# Altium schematic sheet solar_power.SchDoc
size B
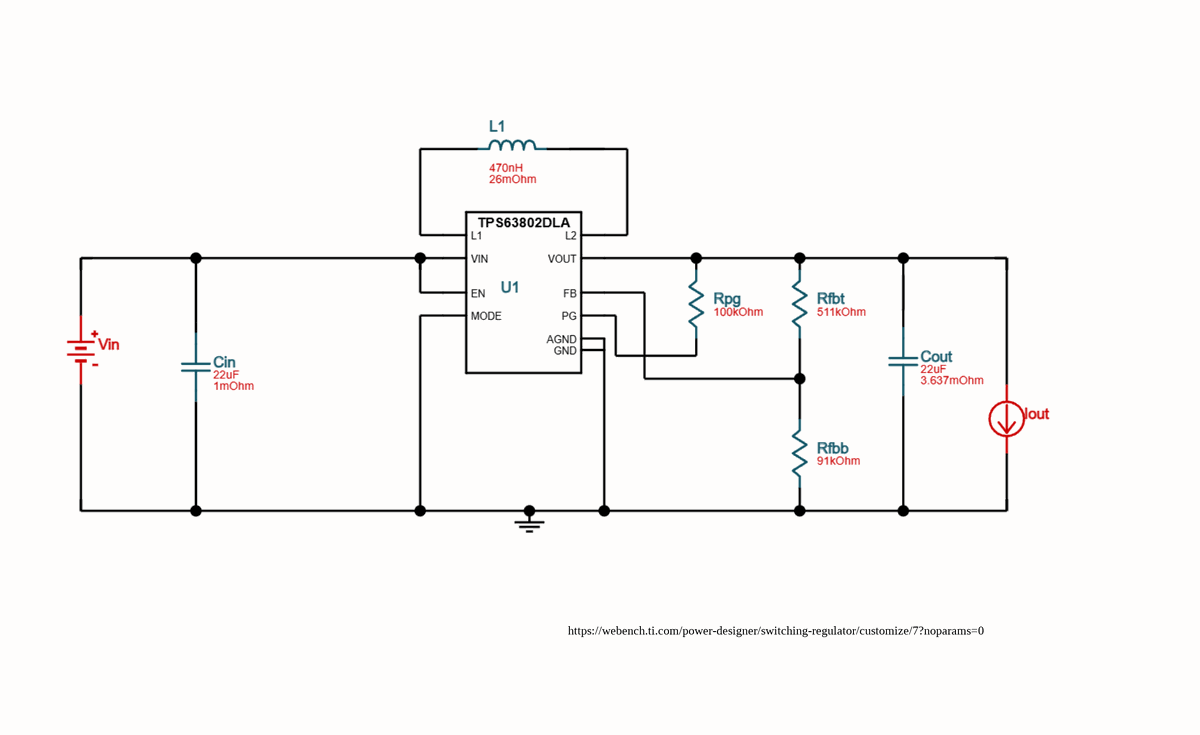
[diagram p0: solar_power.SchDoc, left]
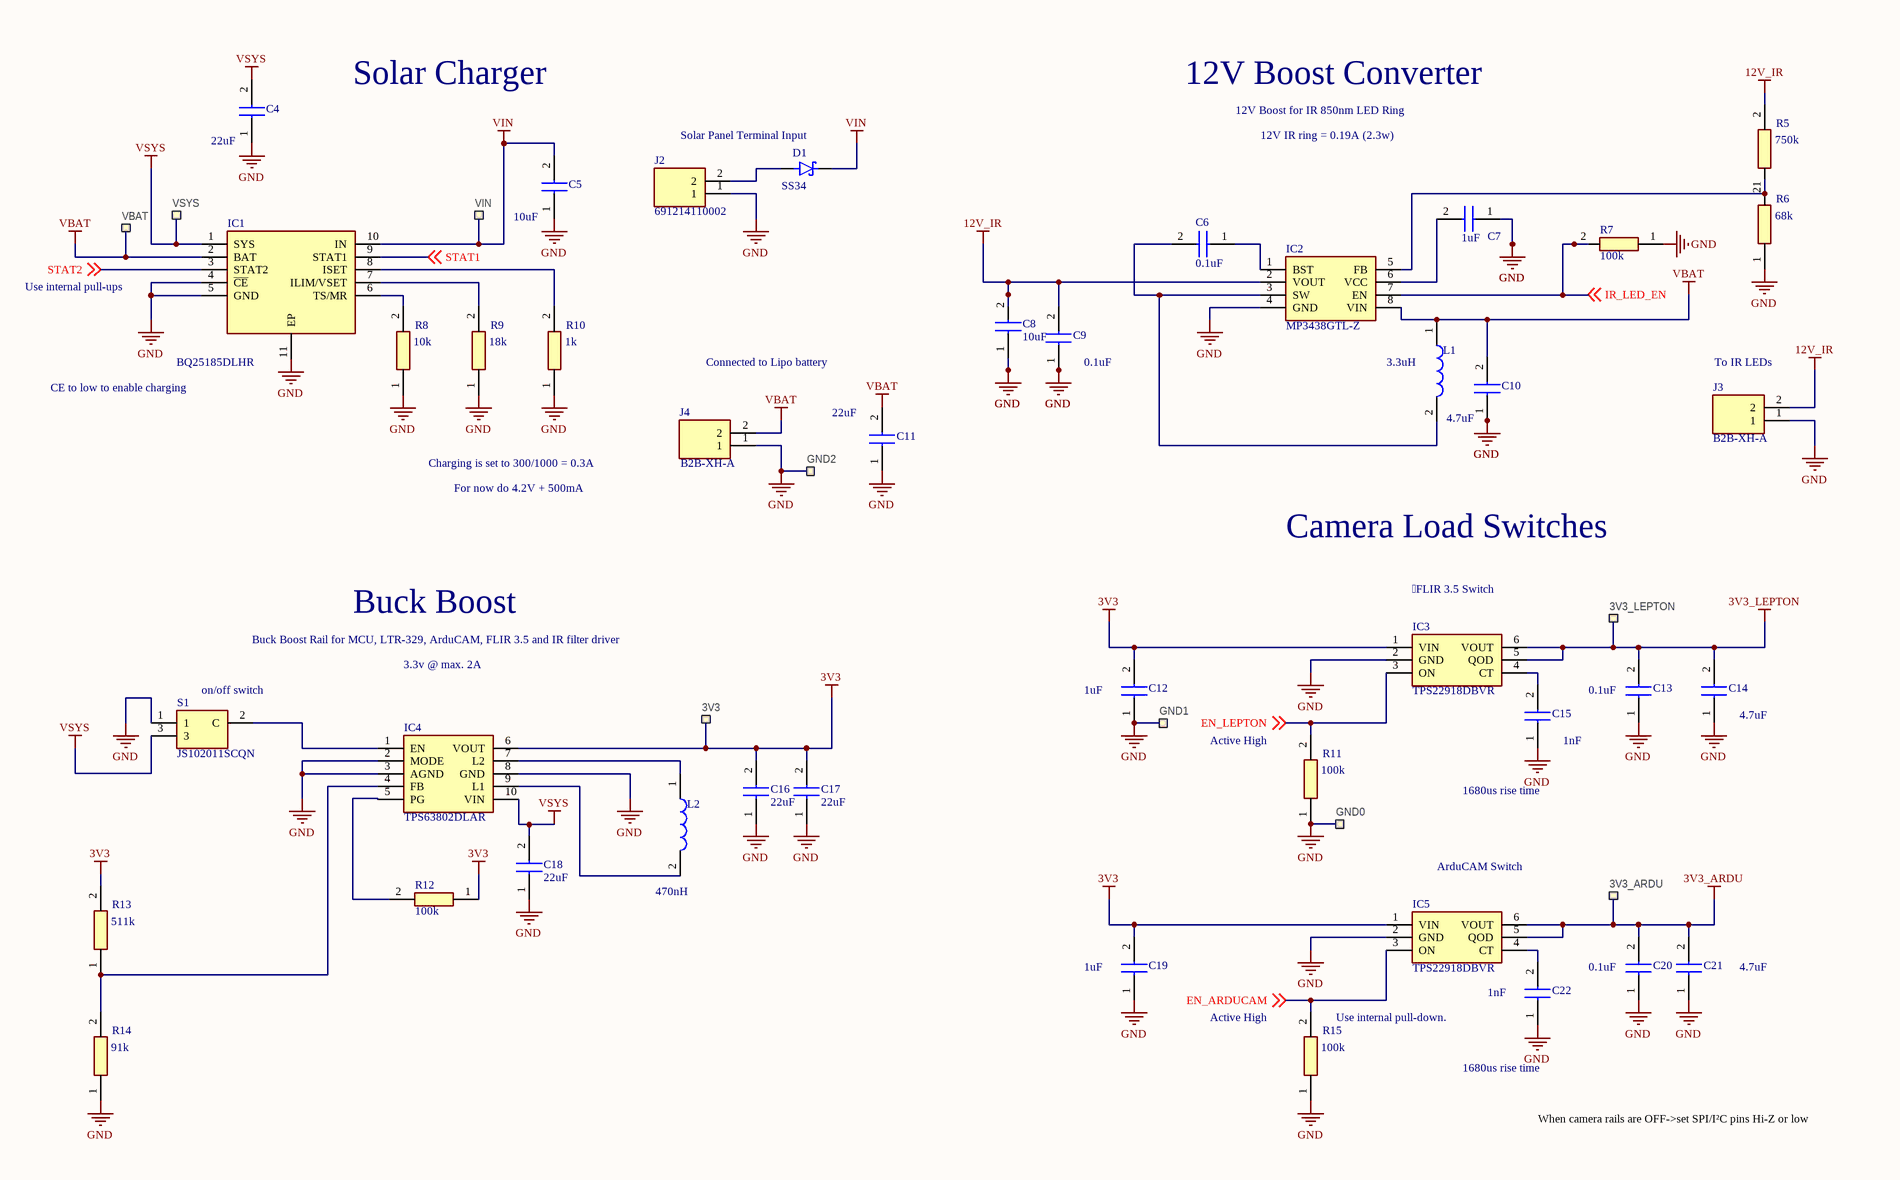
[diagram p1: solar_power.SchDoc, right]

## Parts
3V3  Ø1.0mm,SMD  [TP_SMD_D1.0mm]  (value not drawn)  (no BOM)
3V3_ARDU  Ø1.0mm,SMD  [TP_SMD_D1.0mm]  (value not drawn)  (no BOM)
3V3_LEPTON  Ø1.0mm,SMD  [TP_SMD_D1.0mm]  (value not drawn)  (no BOM)
C4  22uF  [CAPC2114X95N]
C5  10uF  [CAPC2114X95N]
C6  0.1uF  [CAPC1608X90N]
C7  1uF  [CAPC1608X90N]
C8  10uF  [CAPC2114X95N]
C9  0.1uF  [CAPC1608X90N]
C10  4.7uF  [CAPC2114X95N]
C11  22uF  [CAPC2114X95N]
C12  1uF  [CAPC1608X90N]
C13  0.1uF  [CAPC1608X90N]
C14  4.7uF  [CAPC1608X90N]
C15  1nF  [CAPC1608X90N]
C16  22uF  [CAPC2114X95N]
C17  22uF  [CAPC2114X95N]
C18  22uF  [CAPC2114X95N]
C19  1uF  [CAPC1608X90N]
C20  0.1uF  [CAPC1608X90N]
C21  4.7uF  [CAPC1608X90N]
C22  1nF  [CAPC1608X90N]
D1  SS34  [DIOM7959X265N]
GND0  Ø1.0mm,SMD  [TP_SMD_D1.0mm]  (value not drawn)  (no BOM)
GND1  Ø1.0mm,SMD  [TP_SMD_D1.0mm]  (value not drawn)  (no BOM)
GND2  Ø1.0mm,SMD  [TP_SMD_D1.0mm]  (value not drawn)  (no BOM)
IC1  BQ25185DLHR  [SON40P220X200X80-11N]
IC2  MP3438GTL-Z  [SOTFL50P160X60-8N]
IC3  TPS22918DBVR  [SOT95P280X145-6N]
IC4  TPS63802DLAR  [TPS63802DLAR]
IC5  TPS22918DBVR  [SOT95P280X145-6N]
J2  691214110002  [691214110002]
J3  B2B-XH-A  [SHDR2W64P0X250_1X2_740X575X700P]
J4  B2B-XH-A  [SHDR2W64P0X250_1X2_740X575X700P]
L1  3.3uH  [MPLAL40203R3]
L2  470nH  [1285ASH1R0MP2]
R5  750k  [RESC1608X55N]
R6  68k  [RESC1608X55N]
R7  100k  [RESC1608X55N]
R8  10k  [RESC1608X55N]
R9  18k  [RESC1608X55N]
R10  1k  [RESC1608X55N]
R11  100k  [RESC1608X55N]
R12  100k  [RESC1608X55N]
R13  511k  [RESC1608X55N]
R14  91k  [RESC1608X55N]
R15  100k  [RESC1608X55N]
S1  JS102011SCQN  [JS102011SCQN]
VBAT  Ø1.0mm,SMD  [TP_SMD_D1.0mm]  (value not drawn)  (no BOM)
VIN  Ø1.0mm,SMD  [TP_SMD_D1.0mm]  (value not drawn)  (no BOM)
VSYS  Ø1.0mm,SMD  [TP_SMD_D1.0mm]  (value not drawn)  (no BOM)

## Nets
3V3: 3V3.1 C12.2 C16.2 C17.2 C19.2 IC3.1(VIN) IC4.6(VOUT) IC5.1(VIN) R12.1 R13.2
3V3_ARDU: 3V3_ARDU.1 C20.2 C21.2 IC5.5(QOD) IC5.6(VOUT)
3V3_LEPTON: 3V3_LEPTON.1 C13.2 C14.2 IC3.5(QOD) IC3.6(VOUT)
12V_IR: C8.2 C9.2 IC2.2(VOUT) J3.2 R5.2
GND: C4.1 C5.1 C7.1 C8.1 C9.1 C10.1 C11.1 C12.1 C13.1 C14.1 C15.1 C16.1 C17.1 C18.1 C19.1 C20.1 C21.1 C22.1 GND0.1 GND1.1 GND2.1 IC1.4(~{CE}) IC1.5(GND) IC1.11(EP) IC2.4(GND) IC3.2(GND) IC4.2(MODE) IC4.3(AGND) IC4.8(GND) IC5.2(GND) J2.1 J3.1 J4.1 R6.1 R7.1 R8.1 R9.1 R10.1 R11.1 R14.1 R15.1 S1.1
VBAT: C10.2 C11.2 IC1.2(BAT) IC2.8(VIN) J4.2 L1.1 VBAT.1
VIN: C5.2 D1.C(K) IC1.10(IN) VIN.1
VSYS: C4.2 C18.2 IC1.1(SYS) IC4.10(VIN) S1.3 VSYS.1
EN_ARDUCAM: IC5.3(ON) R15.2 ; off-sheet EN_ARDUCAM
EN_LEPTON: IC3.3(ON) R11.2 ; off-sheet EN_LEPTON
IR_LED_EN: IC2.7(EN) R7.2 ; off-sheet IR_LED_EN
STAT1: IC1.9(STAT1) ; off-sheet STAT1
STAT2: IC1.3(STAT2) ; off-sheet STAT2
NetC6_1: C6.1 IC2.1(BST)
NetC6_2: C6.2 IC2.3(SW) L1.2
NetC7_2: C7.2 IC2.6(VCC)
NetC15_2: C15.2 IC3.4(CT)
NetC22_2: C22.2 IC5.4(CT)
NetD1_A: D1.A J2.2
NetIC1_6: IC1.6(TS/MR) R8.2
NetIC1_7: IC1.7(ILIM/VSET) R9.2
NetIC1_8: IC1.8(ISET) R10.2
NetIC2_5: IC2.5(FB) R5.1 R6.2
NetIC4_1: IC4.1(EN) S1.2(C)
NetIC4_4: IC4.4(FB) R13.1 R14.2
NetIC4_5: IC4.5(PG) R12.2
NetIC4_7: IC4.7(L2) L2.1
NetIC4_9: IC4.9(L1) L2.2

## Notes on the sheet
- Solar Charger
- Solar Panel Terminal Input
- 12V Boost Converter
- 12V Boost for IR 850nm LED Ring
- 12V IR ring = 0.19A (2.3w)
- Use internal pull-ups
- (near IC1) CE to low to enable charging
- Connected to Lipo battery
- (near J3) To IR LEDs
- Charging is set to 300/1000 = 0.3A
- For now do 4.2V + 500mA
- Camera Load Switches
- Buck Boost Rail for MCU, LTR-329, ArduCAM, FLIR 3.5 and IR filter driver
- Buck Boost
- (near IC3) FLIR 3.5 Switch
- (near S1) on/off switch
- 3.3v @ max. 2A
- Active High
- 1680us rise time
- (near IC5) ArduCAM Switch
- https://webench.ti.com/power-designer/switching-regulator/customize/7?noparams=0
- (near R15) Active High
- (near R15) Use internal pull-down.
- When camera rails are OFF->set SPI/I²C pins Hi-Z or low

## Library data of the parts
3V3 3V3_ARDU 3V3_LEPTON GND0-GND2 VBAT VIN VSYS = TP_SMD_Ø1.0MM: 1.0mm circular SMD testpad; Manufacturer: Nordic Semiconductor; Manufacturer Part Number: N.A.; Part number NEMS: 100500475; Pad Count: 1; Component Status: Active; Part Number: TP_SMD_Ø1.0MM; LatestRevisionDate: 2021-03-05; Published: 2013-06-11; Value: Ø1.0mm,SMD; Note: N.A.; Artikkelnr Noca: N.A.; Footprint Doc: TP_SMD_Ø1.0mm; Part number IPS: N.A.; ComponentLink1URL: N.A.; ComponentLink1Description: Datasheet; ComponentLink2URL: N.A.; ComponentLink2Description: Supplier link; HelpURL: N.A.; Supplier 1: N.A.; Supplier Part Number 1: N.A.; Supplier 2: N.A.; Supplier Part Number 2: N.A.; Author: rsk; Component Class: Connectors; PartId: 100500475; Part number Norautron: N.A.
C4 C5 C8 C10 C11 C16-C18 = MSASL219LB5226MTNA01: MSASL219LB5226MTNA01 0805 CAP 25V; Manufacturer_Name: TAIYO YUDEN; Datasheet Link: https://4donline.ihs.com/images/VipMasterIC/IC/TAIY/TAIY-S-A0026212580/TAIY-S-A0026212609-1.pdf?hkey=61A2E4C270F0397D049F8F05BD4F1054; Height: 0.95mm; Manufacturer_Part_Number: MSASL219LB5226MTNA01
C6 C7 C9 C12-C14 C19-C21 = CC0603KRX7R0BB104: 0603 CAP X5R 25V; Manufacturer_Name: YAGEO; Datasheet Link: https://www.yageo.com/upload/media/product/products/datasheet/mlcc/UPY-NP0X7R_MV_100-to-630V_21.pdf; Height: 0.9mm; Manufacturer_Part_Number: CC0603KRX7R0BB104; Mouser Part Number: 603-CC603KRX7R0BB104; Mouser Price/Stock: https://www.mouser.co.uk/ProductDetail/YAGEO/CC0603KRX7R0BB104?qs=5eucE5Hus%252BjO6dm3Y8T6pg%3D%3D; Arrow Part Number: CC0603KRX7R0BB104; Arrow Price/Stock: https://www.arrow.com/en/products/cc0603krx7r0bb104/yageo?region=nac
C15 C22 = CC0603KRX7R0BB104: 0603 CAP X5R 50V; Manufacturer_Name: YAGEO; Datasheet Link: https://www.yageo.com/upload/media/product/products/datasheet/mlcc/UPY-NP0X7R_MV_100-to-630V_21.pdf; Height: 0.9mm; Manufacturer_Part_Number: CC0603KRX7R0BB104; Mouser Part Number: 603-CC603KRX7R0BB104; Mouser Price/Stock: https://www.mouser.co.uk/ProductDetail/YAGEO/CC0603KRX7R0BB104?qs=5eucE5Hus%252BjO6dm3Y8T6pg%3D%3D; Arrow Part Number: CC0603KRX7R0BB104; Arrow Price/Stock: https://www.arrow.com/en/products/cc0603krx7r0bb104/yageo?region=nac
D1 = SS34: Diode Schottky 40 V 3A Surface Mount SMC (DO-214AB); MF: onsemi; SnapEDA_Link: https://www.snapeda.com/parts/SS34/Onsemi/view-part/?ref=snap; Package: SMC-2 ON Semiconductor; Value: *; MP: SS34; Check_prices: https://www.snapeda.com/parts/SS34/Onsemi/view-part/?ref=eda
IC1 = BQ25185DLHR: Integrated Circuit; Manufacturer_Name: Texas Instruments; Datasheet Link: https://www.ti.com/lit/ds/symlink/bq25185.pdf?ts=1706857561339&ref_url=https%253A%252F%252Fwww.ti.com%252Fproduct%252FBQ25185; Height: 0.8mm; Manufacturer_Part_Number: BQ25185DLHR; Mouser Part Number: 595-BQ25185DLHR; Mouser Price/Stock: https://www.mouser.co.uk/ProductDetail/Texas-Instruments/BQ25185DLHR?qs=Z%252BL2brAPG1IbO%2FV3RqsaPw%3D%3D
IC2 = MP3438GTL-Z: Integrated Circuit; Manufacturer_Name: Monolithic Power Systems (MPS); Datasheet Link: https://www.monolithicpower.com/en/documentview/productdocument/index/version/2/document_type/Datasheet/lang/en/sku/MP3438GTL/; Height: 0.6mm; Manufacturer_Part_Number: MP3438GTL-Z; Mouser Part Number: 946-MP3438GTL-Z; Mouser Price/Stock: https://www.mouser.co.uk/ProductDetail/Monolithic-Power-Systems-MPS/MP3438GTL-Z?qs=tlsG%2FOw5FFjfFO8TaWv5UA%3D%3D
IC3 IC5 = TPS22918DBVR: Integrated Circuit; Manufacturer_Name: Texas Instruments; Datasheet Link: http://www.ti.com/lit/gpn/TPS22918; Height: 1.45mm; Manufacturer_Part_Number: TPS22918DBVR; Mouser Part Number: 595-TPS22918DBVR; Mouser Price/Stock: https://www.mouser.co.uk/ProductDetail/Texas-Instruments/TPS22918DBVR?qs=f4l5qYp%2Fy%252B5F7w5ZAgmi7A%3D%3D; Arrow Part Number: TPS22918DBVR; Arrow Price/Stock: https://www.arrow.com/en/products/tps22918dbvr/texas-instruments?utm_currency=USD&region=nac
IC4 = TPS63802DLAR: Integrated Circuit; Manufacturer_Name: Texas Instruments; Datasheet Link: http://www.ti.com/lit/ds/symlink/tps63802.pdf; Height: 1mm; Manufacturer_Part_Number: TPS63802DLAR; Mouser Part Number: 595-TPS63802DLAR; Mouser Price/Stock: https://www.mouser.co.uk/ProductDetail/Texas-Instruments/TPS63802DLAR?qs=9r4v7xj2Lnmr2ylyTiX9Mg%3D%3D; Arrow Part Number: TPS63802DLAR; Arrow Price/Stock: https://www.arrow.com/en/products/tps63802dlar/texas-instruments?utm_currency=USD&region=nac
J2 = 691214110002: Connector; Manufacturer_Name: Wurth Elektronik; Datasheet Link: https://www.we-online.com/components/products/download/3D_691214110002+%28rev1%29.pdf; Height: 8.7mm; Manufacturer_Part_Number: 691214110002; Mouser Part Number: 710-691214110002; Mouser Price/Stock: https://www.mouser.co.uk/ProductDetail/Wurth-Elektronik/691214110002?qs=7gQLVZk5cPmb9EqUyfv%252B2g%3D%3D
J3 J4 = B2B-XH-A: Connector; Manufacturer_Name: JST (JAPAN SOLDERLESS TERMINALS); Datasheet Link: https://order.jst-mfg.com/InternetShop/app/pdf_show.php?kbn=3&key=XH%20CONNECTOR%20THROUGH-HOLE%20TYPE%20SHROUDED%20HEADER.pdf; Height: 7mm; Manufacturer_Part_Number: B2B-XH-A
L1 = MPL-AL4020-3R3: Manufacturer_Name: Monolithic Power Systems (MPS); Datasheet Link: https://www.monolithicpower.com/en/documentview/productdocument/index/version/2/document_type/Datasheet/lang/en/sku/MPL-AL4020-3R3/document_id/5795/; Height: 2.1mm; Manufacturer_Part_Number: MPL-AL4020-3R3; Mouser Part Number: 946-MPL-AL4020-3R3; Mouser Price/Stock: https://www.mouser.co.uk/ProductDetail/Monolithic-Power-Systems-MPS/MPL-AL4020-3R3?qs=sPbYRqrBIVnE90fmE2PrGQ%3D%3D
L2 = DFE201610E-R47M=P2: Manufacturer_Name: Murata Electronics; Datasheet Link: https://search.murata.co.jp/Ceramy/image/img/P02/J(E)TE243A-0001.pdf; Height: 1mm; Manufacturer_Part_Number: DFE201610E-R47M=P2; Mouser Part Number: 81-DFE201610E-R47MP2; Mouser Price/Stock: https://www.mouser.co.uk/ProductDetail/Murata-Electronics/DFE201610E-R47M%3dP2?qs=AQlKX63v8RtBvyqMdluN2g%3D%3D; Arrow Part Number: DFE201610E-R47M=P2; Arrow Price/Stock: https://www.arrow.com/en/products/dfe201610e-r47mp2/murata-manufacturing?utm_currency=USD&region=nac
R5 R6 = RC0603FR0710KL: Resistor SMD 0603 1% 0.25W; Manufacturer_Name: YAGEO; Datasheet Link: http://www.yageo.com/documents/recent/PYu-RC0603_51_RoHS_L_v5.pdf; Height: 0.55mm; Manufacturer_Part_Number: RC0603FR0710KL; Arrow Part Number: RC0603FR0710KL; Arrow Price/Stock: https://www.arrow.com/en/products/rc0603fr-0710kl/yageo
R7 R11 R12 R15 = RC0603FR0710KL: Resistor SMD 0603 1% 0.1W; Manufacturer_Name: YAGEO; Datasheet Link: http://www.yageo.com/documents/recent/PYu-RC0603_51_RoHS_L_v5.pdf; Height: 0.55mm; Manufacturer_Part_Number: RC0603FR0710KL; Arrow Part Number: RC0603FR0710KL; Arrow Price/Stock: https://www.arrow.com/en/products/rc0603fr-0710kl/yageo
R8-R10 R13 R14 = RC0603FR0710KL: Resistor SMD 0603 1% 1/10; Manufacturer_Name: YAGEO; Datasheet Link: http://www.yageo.com/documents/recent/PYu-RC0603_51_RoHS_L_v5.pdf; Height: 0.55mm; Manufacturer_Part_Number: RC0603FR0710KL; Arrow Part Number: RC0603FR0710KL; Arrow Price/Stock: https://www.arrow.com/en/products/rc0603fr-0710kl/yageo
S1 = JS102011SCQN: Switch; Manufacturer_Name: C & K COMPONENTS; Datasheet Link: https://www.ckswitches.com/media/1422/js.pdf; Height: 5mm; Manufacturer_Part_Number: JS102011SCQN; Mouser Part Number: 611-JS102011SCQN; Mouser Price/Stock: https://www.mouser.co.uk/ProductDetail/CK/JS102011SCQN?qs=aIxPIZZxLh%2FC%2Fw7UJtfwsg%3D%3D; Arrow Part Number: JS102011SCQN; Arrow Price/Stock: https://www.arrow.com/en/products/js102011scqn/ck?utm_currency=USD&region=nac